# EAGLE design sousvide2 (EAGLE 7.6.0)
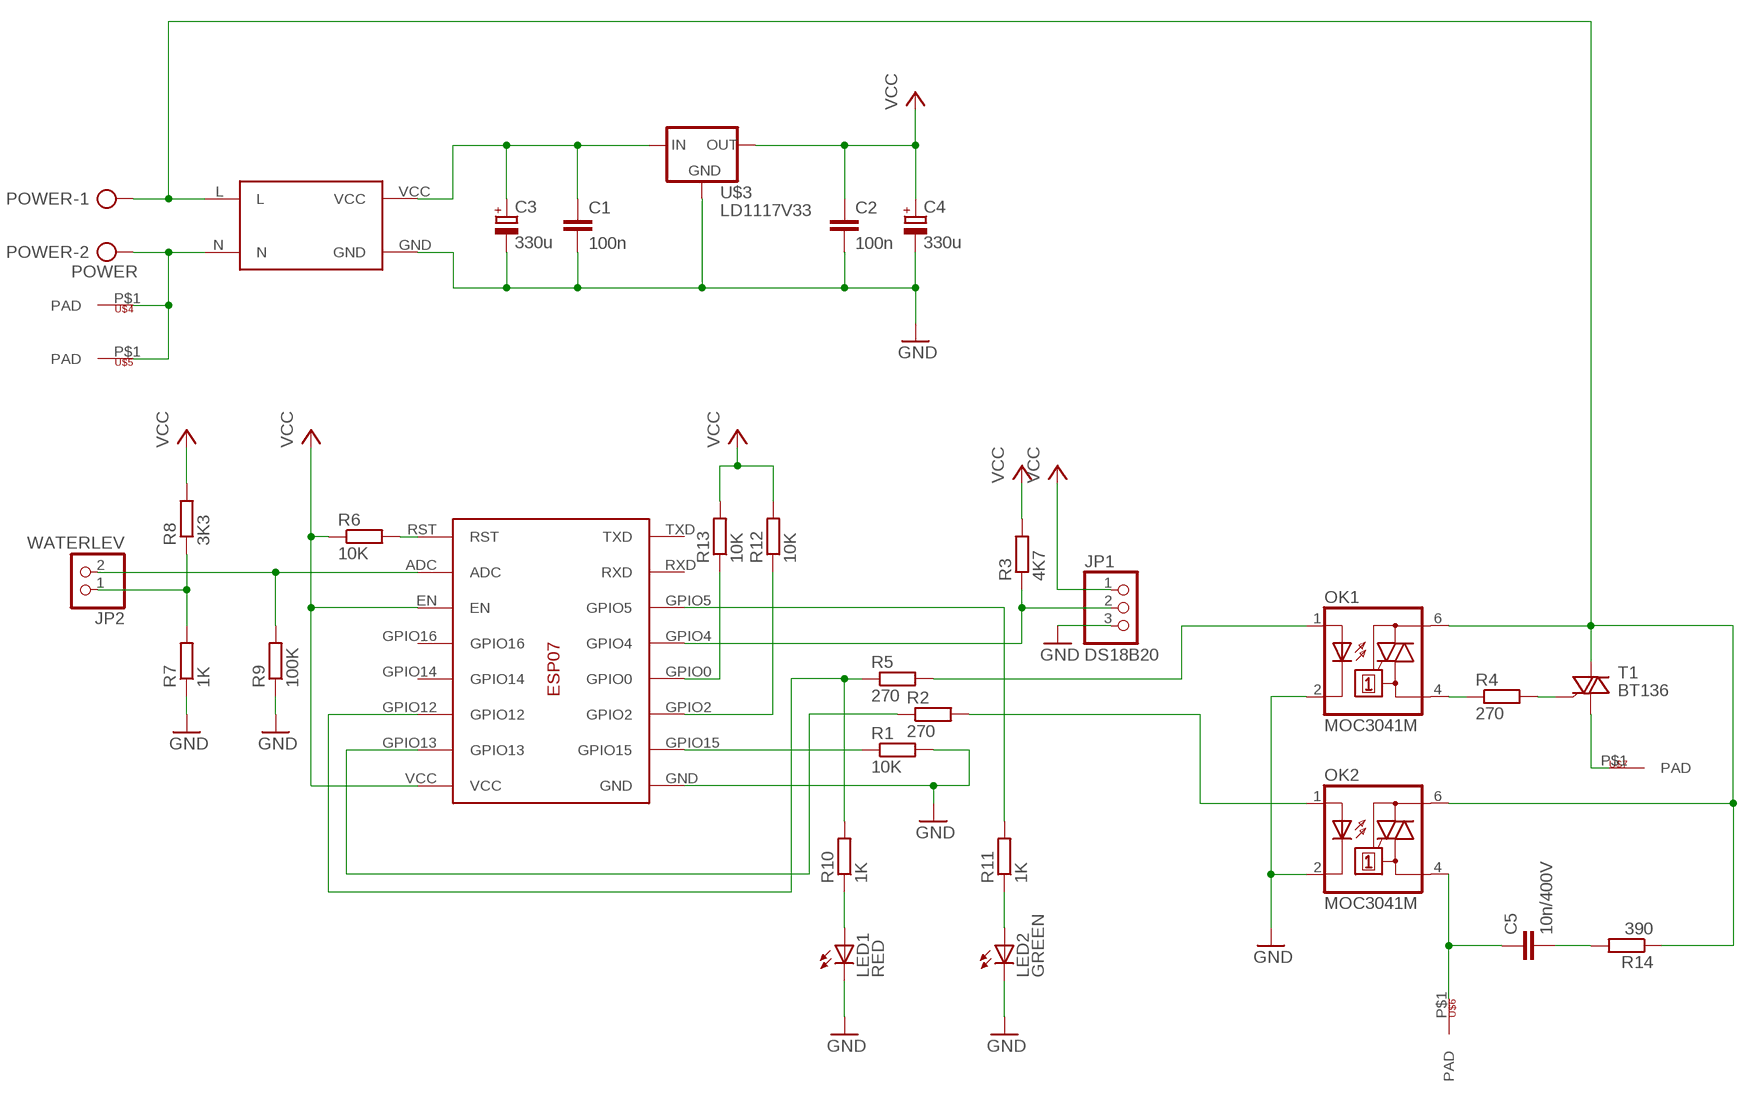
[diagram p0: schematic, sheet 1]

## Parts
C1  100n  C-EU050-025X075  [C050-025X075]
C2  100n  C-EU050-025X075  [C050-025X075]
C3  330u  CPOL-EUE2.5-6  [E2,5-6]
C4  330u  CPOL-EUE2.5-6  [E2,5-6]
C5  10n/400V  C-EU102-064X133  [C102-064X133]
JP1  DS18B20  PINHD-1X3  [1X03]
JP2  WATERLEV  PINHD-1X2  [1X02]
LED1  RED  LED5MM  [LED5MM]
LED2  GREEN  LED5MM  [LED5MM]
OK1  MOC3041M  [DIL06]
OK2  MOC3041M  [DIL06]
POWER  POWER  AK300/2  [AK300/2]
R1  10K  R-EU_0204/7  [0204/7]
R2  270  R-EU_0204/7  [0204/7]
R3  4K7  R-EU_0204/7  [0204/7]
R4  270  R-EU_0204/7  [0204/7]
R5  270  R-EU_0207/12  [0207/12]
R6  10K  R-EU_0204/7  [0204/7]
R7  1K  R-EU_0204/7  [0204/7]
R8  3K3  R-EU_0204/7  [0204/7]
R9  100K  R-EU_0204/7  [0204/7]
R10  1K  R-EU_0204/7  [0204/7]
R11  1K  R-EU_0207/10  [0207/10]
R12  10K  R-EU_0204/7  [0204/7]
R13  10K  R-EU_0204/7  [0204/7]
R14  390  R-EU_0207/7  [0207/7]
T1  BT136  [TO220AB]
U$1  ESP12F  ESP07  [ESP07]
U$2  PSU5V1A  [PSU5V]
U$3  LD1117V33  [LD1117V33]
U$4  PAD  [PAD]
U$5  PAD  [PAD]
U$6  PAD  [PAD]
U$7  PAD  [PAD]

## Nets
GND: C1.2 C2.2 C3.- C4.- JP1.3 LED1.K(C) LED2.K(C) OK1.2(C) OK2.2(C) R1.2 R7.1 R9.1 U$1.GND U$2.GND U$3.GND
N$1: R1.1 U$1.GPIO15
N$2: R2.1 U$1.GPIO13
N$3: OK1.4(A1) R4.1
N$4: R4.2 T1.3(G)
N$5: C1.1 C3.+ U$2.VCC U$3.IN
N$6: POWER.2 U$2.N U$4.P$1(PAD) U$5.P$1(PAD)
N$7: OK1.6(A2) OK2.6(A2) POWER.1 R14.1 T1.2(A2) U$2.L
N$8: LED1.A R10.1
N$9: T1.1(A1) U$7.P$1(PAD)
N$10: R13.1 U$1.GPIO0
N$11: R5.1 R10.2 U$1.GPIO12
N$12: OK1.1(A) R5.2
N$13: LED2.A R11.1
N$14: OK2.1(A) R2.2
N$15: R11.2 U$1.GPIO5
N$16: C5.1 OK2.4(A1) U$6.P$1(PAD)
N$17: JP1.2 R3.1 U$1.GPIO4
N$18: R12.1 U$1.GPIO2
N$19: R6.2 U$1.RST
N$20: JP2.2 R9.2 U$1.ADC
N$21: JP2.1 R7.2 R8.1
N$22: C5.2 R14.2
VCC: C2.1 C4.+ JP1.1 R3.2 R6.1 R8.2 R12.2 R13.2 U$1.EN U$1.VCC U$3.OUT
Unconnected: U$1.GPIO14 U$1.GPIO16 U$1.RXD U$1.TXD

## Library data of the parts
C1 C2 = rcl:C-EU: CAPACITOR, European symbol
C3 C4 = rcl:CPOL-EU: POLARIZED CAPACITOR, European symbol
C5 = resistor:C-EU: CAPACITOR, European symbol
JP1 = pinhead:PINHD-1X3: PIN HEADER
JP2 = pinhead:PINHD-1X2: PIN HEADER
LED1 LED2 = adafruit:LED: LED OSRAM: - CHIPLED LG R971, LG N971, LY N971, LG Q971, LY Q971, LO R971, LY R971 LH N974, LH R974 LS Q976, LO Q976, LY Q976 LO Q996 - Hyper CHIPLED LW Q18S LB Q993, LB Q99A, LB R99A - SideLED LS A670, LO A670, LY A670, LG A670, LP A670 LB A673, LV A673, LT A673, LW A673 LH A674 LY A675 LS A676, LA A676, LO A676, LY A676, LW A676 LS A679, LY A679, LG A679 - Hyper Micro SIDELED® LS Y876, LA Y876, LO Y876, LY Y876 LT Y87S - SmartLED LW L88C, LW L88S LB L89C, LB L89S, LG L890 LS L89K, LO L89K, LY L89K LS L896, LA L896, LO L896, LY L896 - TOPLED LS T670, LO T670, LY T670, LG T670, LP T670 LSG T670, LSP T670, LSY T670, LOP T670, LYG T670 LG T671, LOG T671, LSG T671 LB T673, LV T673, LT T673, LW T673 LH T674 LS T676, LA T676, LO T676, LY T676, LB T676, LH T676, LSB T676, LW T676 LB T67C, LV T67C, LT T67C, LS T67K, LO T67K, LY T67K, LW E67C LS E67B, LA E67B, LO E67B, LY E67B, LB E67C, LV E67C, LT E67C LW T67C LS T679, LY T679, LG T679 LS T770, LO T770, LY T770, LG T770, LP T770 LB T773, LV T773, LT T773, LW T773 LH T774 LS E675, LA E675, LY E675, LS T675 LS T776, LA T776, LO T776, LY T776, LB T776 LHGB T686 LT T68C, LB T68C - Hyper Mini TOPLED® LB M676 - Mini TOPLED Santana® LG M470 LS M47K, LO M47K, LY M47K Source: http://www.osram.convergy.de/
OK1 OK2 = optocoupler:MOC30*: 6-Pin DIP Zero-Cross Optoisolators Triac Driver Output (250/400 Volt Peak) Source: Data sheet <http://www.fairchildsemi.com/ds/MO/MOC3031M.pdf> The old path of data sheet not more available 2013-05-06.; MF: FAIRCHILD SEMICONDUCTOR; MPN: MOC3041M; OC_FARNELL: 1086677; OC_NEWARK: 78K6090
POWER = con-ptr500:AK300/2: CONNECTOR; OC_FARNELL: unknown; OC_NEWARK: unknown
R1-R14 = rcl:R-EU_: RESISTOR, European symbol
T1 = triac:BT136: Triac BT136 series E sensitive gate Source: http://www.nxp.com/acrobat_download/datasheets/BT136_SERIES_E_2.pdf
U$1 = esp07adapter:ESP07
U$2 = psu_5v:PSU5V1A: PSU 5V/1A from China
U$3 = LD1117V33:LD1117V33
U$4-U$7 = LEG-1A-5:PAD

## Board
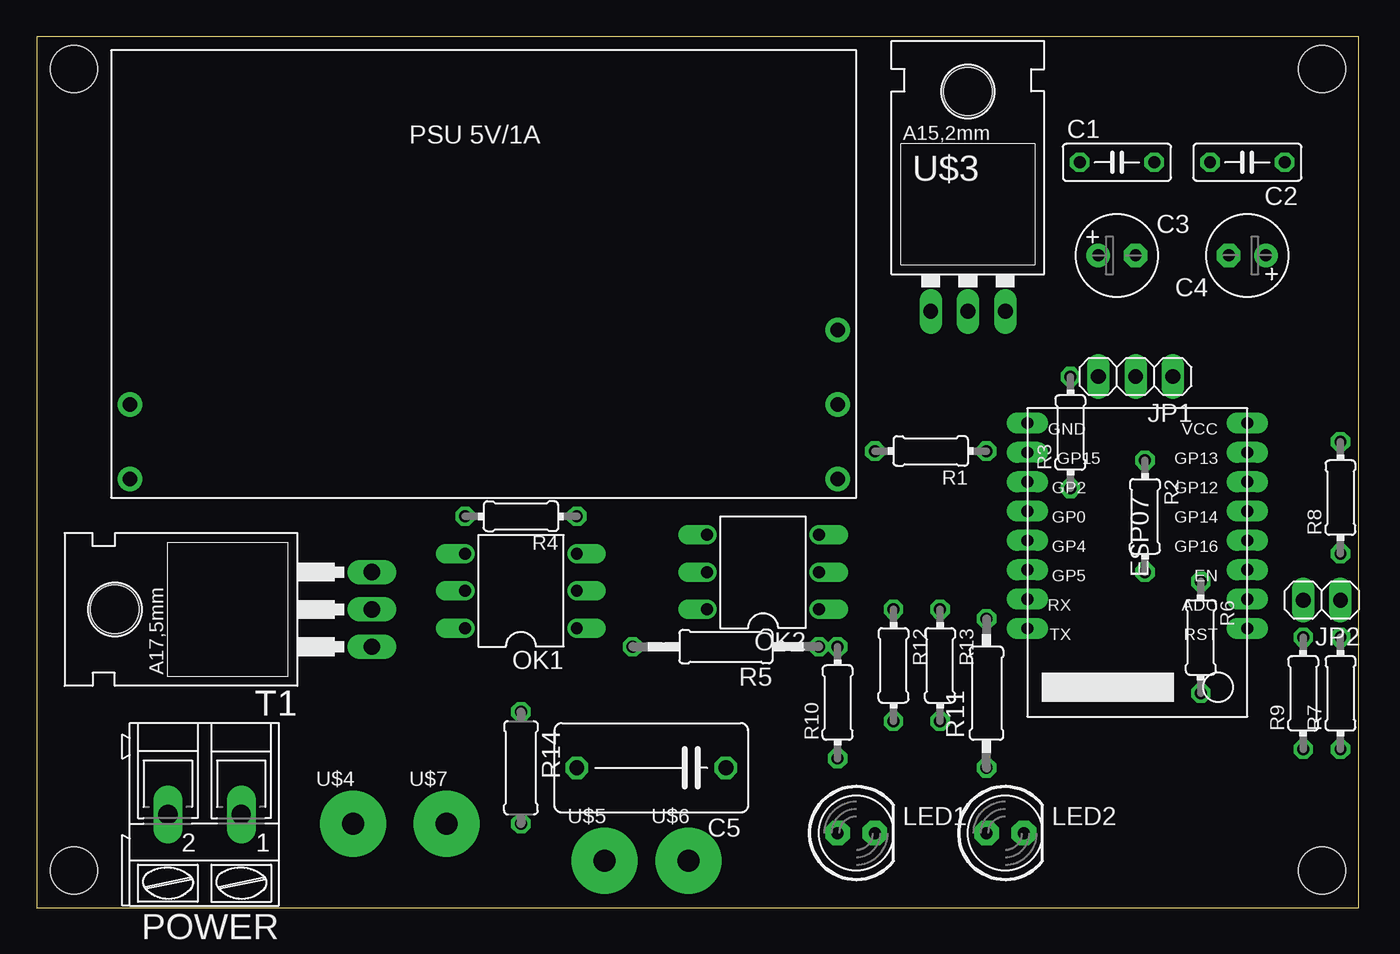
[diagram p1: board, top side]
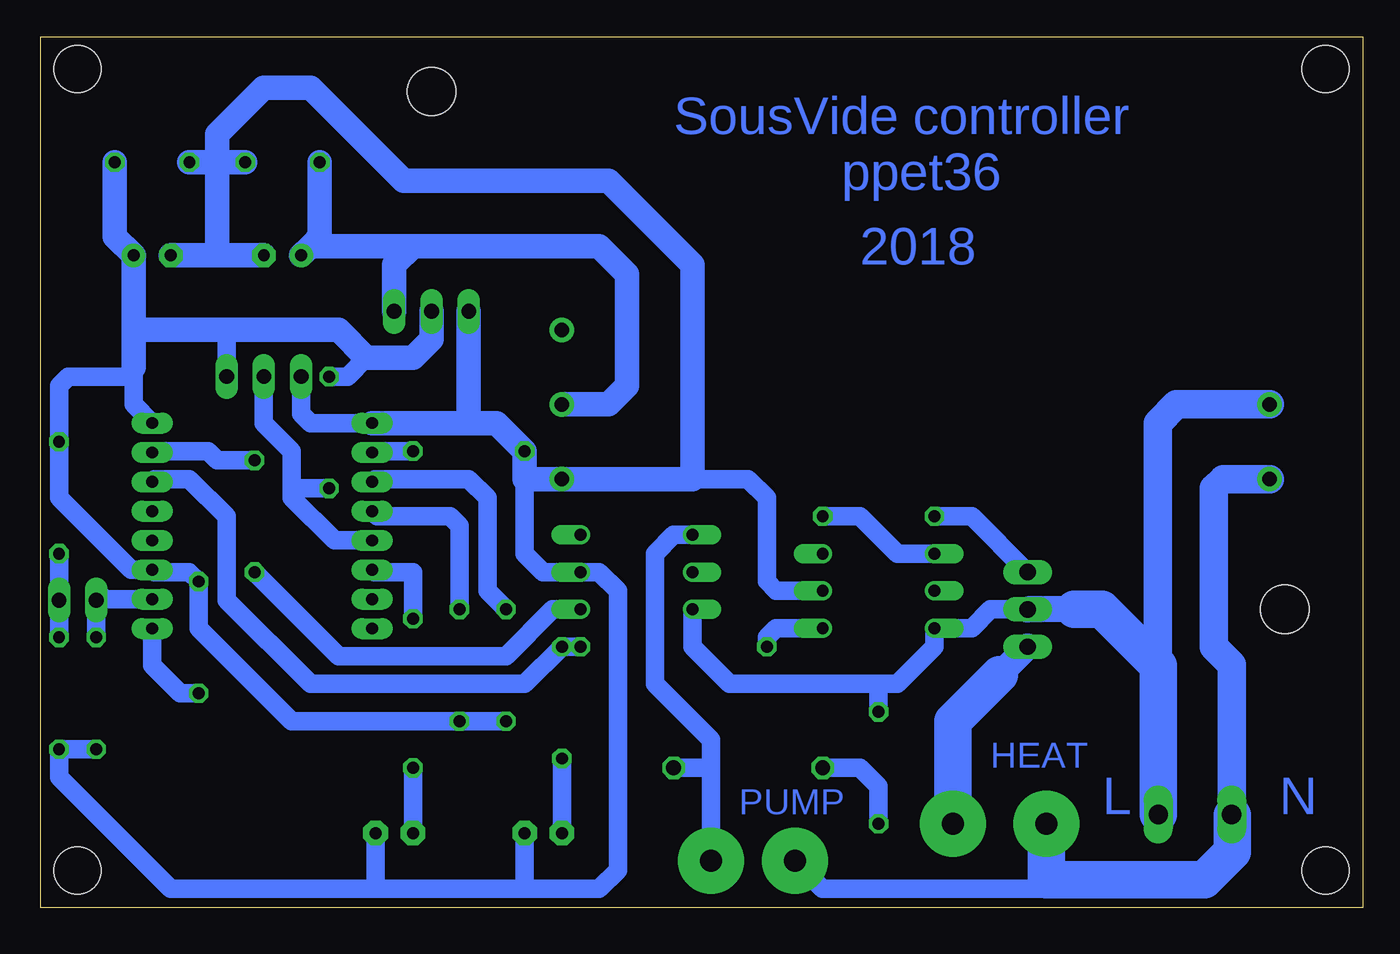
[diagram p2: board, bottom side, seen from below]

Size 90.15 x 59.36 mm. Coordinates in mm from the lower left corner, seen from the top.
Outline: 0,0 90.15,0 90.15,59.36 0,59.36 0,0
Copper layers (1*16): Top 0.035mm / dielectric 1.5mm / Bottom 0.035mm
Design rules "default": minimum track width 10mil, minimum drill 24mil, track to track 8mil, track to pad 8mil, pad to pad 8mil, via to via 8mil, smd to smd 8mil, copper to edge 40mil, drill to drill 8mil, minimum pad ring 10mil, minimum via ring 8mil, stop-mask expansion 4mil, vias tented up to drill 0mil, thermal gap 10mil
Holes 3.2 mm at 2.54,2.54 87.63,2.54 2.54,57.15 87.63,57.15

### Footprints (pad centres in the part's own frame; a part is rotated, then mirrored left to right if it is on the bottom)
C050-025X075 = drill 0.813 octagon: 1 -2.54,0; 2 2.54,0
E2,5-6 = drill 0.813 pad 1.6: + -1.27,0 | drill 0.813 pad 1.6 octagon: - 1.27,0
C102-064X133 = drill 1.016 octagon: 1 -5.08,0; 2 5.08,0
1X03 = drill 1.016 long: 1 -2.54,0; 2 0,0; 3 2.54,0
1X02 = drill 1.016 long: 1 -1.27,0; 2 1.27,0
LED5MM = drill 0.813 pad 1.676 octagon: A -1.27,0; K 1.27,0
DIL06 = drill 0.813 offset: 1 -2.54,-3.81; 2 0,-3.81; 3 2.54,-3.81; 4 2.54,3.81; 5 0,3.81; 6 -2.54,3.81
AK300/2 = drill 1.321 long: 1 -2.515,0; 2 2.489,0
0204/7 = drill 0.813 octagon: 1 -3.81,0; 2 3.81,0
0207/12 = drill 0.813 octagon: 1 -6.35,0; 2 6.35,0
0207/10 = drill 0.813 octagon: 1 -5.08,0; 2 5.08,0
0207/7 = drill 0.813 octagon: 1 -3.81,0; 2 3.81,0
TO220AB = drill 1.118 long: 1 -2.54,-6.35; 2 0,-6.35; 3 2.54,-6.35 | hole 3.302: 0,11.176
ESP07 = drill 0.8 pad 1.422 long: ADC 0,12; EN 0,10; GND 15,0; GPIO0 15,6; GPIO2 15,4; GPIO4 15,8; GPIO5 15,10; GPIO12 0,4; GPIO13 0,2; GPIO14 0,6; GPIO15 15,2; GPIO16 0,8; RST 0,14; RXD 15,12; TXD 15,14; VCC 0,0
PSU5V = drill 1 pad 1.676: GND 49.53,1.27; L 1.27,6.35; N 1.27,1.27; NC 49.53,11.43; VCC 49.53,6.35
LD1117V33 = drill 1.016 long: GND -2.54,-8.89; IN 2.54,-8.89; OUT 0,-8.89 | hole 3.302: 0,6.096
PAD = drill 1.5 pad 4.5: P$1 0,0

### Placement (x,y rotation side)
C1  73.66,50.8 0 top
C2  82.55,50.8 180 top
C3  73.66,44.45 0 top
C4  82.55,44.45 180 top
C5  41.91,9.53 180 top
JP1  74.93,36.2 180 top
JP2  87.63,20.95 180 top
LED1  55.88,5.08 0 top
LED2  66.04,5.08 0 top
OK1  33.02,21.59 90 top
OK2  49.53,22.86 90 top
POWER  11.43,6.35 180 top
R1  60.96,31.11 180 top
R2  75.56,26.67 270 top
R3  70.48,32.38 90 top
R4  33.02,26.67 180 top
R5  46.99,17.78 180 top
R6  79.38,18.41 270 top
R7  88.9,14.61 90 top
R8  88.9,27.94 90 top
R9  86.36,14.61 90 top
R10  54.61,13.97 90 top
R11  64.77,14.61 90 top
R12  58.42,16.51 270 top
R13  61.59,16.51 270 top
R14  33.02,9.53 270 top
T1  16.51,20.32 90 top
U$1  82.55,33.02 180 top
U$2  5.08,27.94 0 top
U$3  63.5,49.53 0 top
U$4  21.59,5.71 0 top
U$5  38.73,3.17 0 top
U$6  44.45,3.17 0 top
U$7  27.94,5.71 0 top

### Tracks (layer width: path | path; a pad name or v marks a point on that pad's centre or on a via)
GND
  Bottom 1.27: 45.72,29.21 41.91,29.21 40.64,27.94 40.64,22.23 40.01,21.59 OK1.2 | 57.15,1.27 52.07,1.27 50.8,2.54 50.8,21.59 52.07,22.86 OK2.2 55.88,22.86 57.15,24.13 57.15,29.21 | 57.15,1.27 67.31,1.27 | LED1.K 57.15,1.27 | LED2.K 67.31,1.27 | 67.31,1.27 81.28,1.27 88.9,8.89 R7.1 R9.1 | JP1.3 72.39,33.66 71.75,33.02 U$1.GND
  Bottom 1.676: U$1.GND 60.96,33.02 | 60.96,33.02 59.05,33.02 R1.2 57.15,29.21 U$2.GND 45.72,29.21 45.72,43.81 51.44,49.53 65.41,49.53 71.75,55.88 74.93,55.88 78.11,52.7 78.11,50.8 | U$3.GND 60.96,33.02 | C1.2 78.11,50.8 | 78.11,44.45 C4.- | C2.2 78.11,50.8 | 78.11,50.8 78.11,44.45 | C3.- 78.11,44.45
N$1
  Bottom 1.27: R1.1 67.45,31.11 U$1.GPIO15
N$2
  Bottom 1.27: R2.1 78.11,30.48 78.74,31.11 82.45,31.11 U$1.GPIO13
N$3
  Bottom 1.27: OK1.4 31.75,24.13 34.29,26.67 R4.1
N$4
  Bottom 1.27: R4.2 26.67,26.67 T1.3
N$5
  Bottom 1.676: U$2.VCC 51.44,34.29 50.16,35.56 50.16,43.18 52.07,45.09 64.77,45.09 | U$3.IN 66.04,43.81 64.77,45.09 | C1.1 71.12,45.72 71.75,45.09 | 71.75,45.09 C3.+ | 64.77,45.09 71.75,45.09
N$6
  Bottom 1.27: 21.59,1.91 21.59,1.27 36.83,1.27 U$5.P$1
  Bottom 1.676: 8.89,6.3 POWER.2
  Bottom 1.93: POWER.2 8.94,16.56 10.16,17.78 10.16,28.57 9.53,29.21 U$2.N
  Bottom 2.54: 8.89,6.3 8.89,3.81 10.79,1.91 21.59,1.91 U$4.P$1
N$7
  Bottom 1.27: 33.02,15.24 31.75,15.24 29.21,17.78 OK1.6 26.67,19.05 25.4,20.32 T1.2 | 33.02,15.24 43.18,15.24 45.72,17.78 OK2.6 | R14.1 33.02,15.24
  Bottom 1.778: 19.68,20.32 T1.2
  Bottom 1.93: 13.95,16.48 13.97,16.51 | 13.97,16.51 13.97,33.02 12.7,34.29 U$2.L | 13.97,15.24 13.97,16.51
  Bottom 2.54: POWER.1 13.95,16.48 | 13.97,16.51 17.78,20.32 19.68,20.32
N$8
  Bottom 1.27: LED1.A R10.1
N$9
  Bottom 1.778: 24.77,15.88 T1.1
  Bottom 2.54: 24.77,15.88 27.94,12.7 U$7.P$1
N$10
  Bottom 1.27: R13.1 61.59,26.04 62.23,26.67 67.2,26.67 U$1.GPIO0
N$11
  Bottom 1.27: R5.1 R10.2 57.15,15.24 71.75,15.24 77.47,20.95 77.47,26.67 80.01,29.21 82.36,29.21 U$1.GPIO12
N$12
  Bottom 1.27: R5.2 40.64,18.41 40.01,19.05 OK1.1
N$13
  Bottom 1.27: LED2.A R11.1
N$14
  Bottom 1.27: R2.2 69.85,17.14 58.42,17.14 55.24,20.32 OK2.1
N$15
  Bottom 1.27: R11.2 64.77,22.86 67.39,22.86 U$1.GPIO5
N$16
  Bottom 1.27: OK2.4 46.99,25.4 48.26,24.13 48.26,15.24 44.45,11.43 44.45,9.53 | U$6.P$1 44.45,9.53 | C5.1 44.45,9.53
N$17
  Bottom 1.27: U$1.GPIO4 70.11,25.02 73.03,27.94 73.03,28.57 | 73.03,28.57 73.03,31.11 74.93,33.02 JP1.2 | R3.1 73.03,28.57
N$18
  Bottom 1.27: U$1.GPIO2 67.36,29.21 60.96,29.21 59.69,27.94 59.69,21.59 R12.1
N$19
  Bottom 1.27: 82.52,19.05 U$1.RST 82.55,16.51 80.64,14.61 R6.2
N$20
  Bottom 1.27: R9.2 JP2.2 86.36,21.59 85.79,21.02 U$1.ADC
N$21
  Bottom 1.27: R7.2 JP2.1 R8.1
N$22
  Bottom 1.27: C5.2 34.29,9.53 33.02,8.26 R14.2
VCC
  Bottom 1.27: R3.2 69.22,36.2 67.94,37.47 | 83.82,36.2 88.27,36.2 88.9,35.56 R8.2 88.9,27.94 83.98,23.02 U$1.EN 82.39,22.86 80.01,22.86 R6.1 79.38,19.05 73.03,12.7 R13.2 R12.2 | 83.82,36.83 83.82,36.2 | JP1.1 77.47,39.37 | U$1.VCC 83.82,34.29 83.82,36.2
  Bottom 1.676: U$3.OUT 63.5,38.73 64.77,37.47 67.94,37.47 69.85,39.37 77.47,39.37 83.82,39.37 | C2.1 85.09,45.72 C4.+ 83.82,39.37 | 83.82,39.37 83.82,36.83

### Text on the board
Bottom: SousVide controller | ppet36 | 2018 | HEAT | N | L | PUMP